# Altium project chess_module.PrjPcb
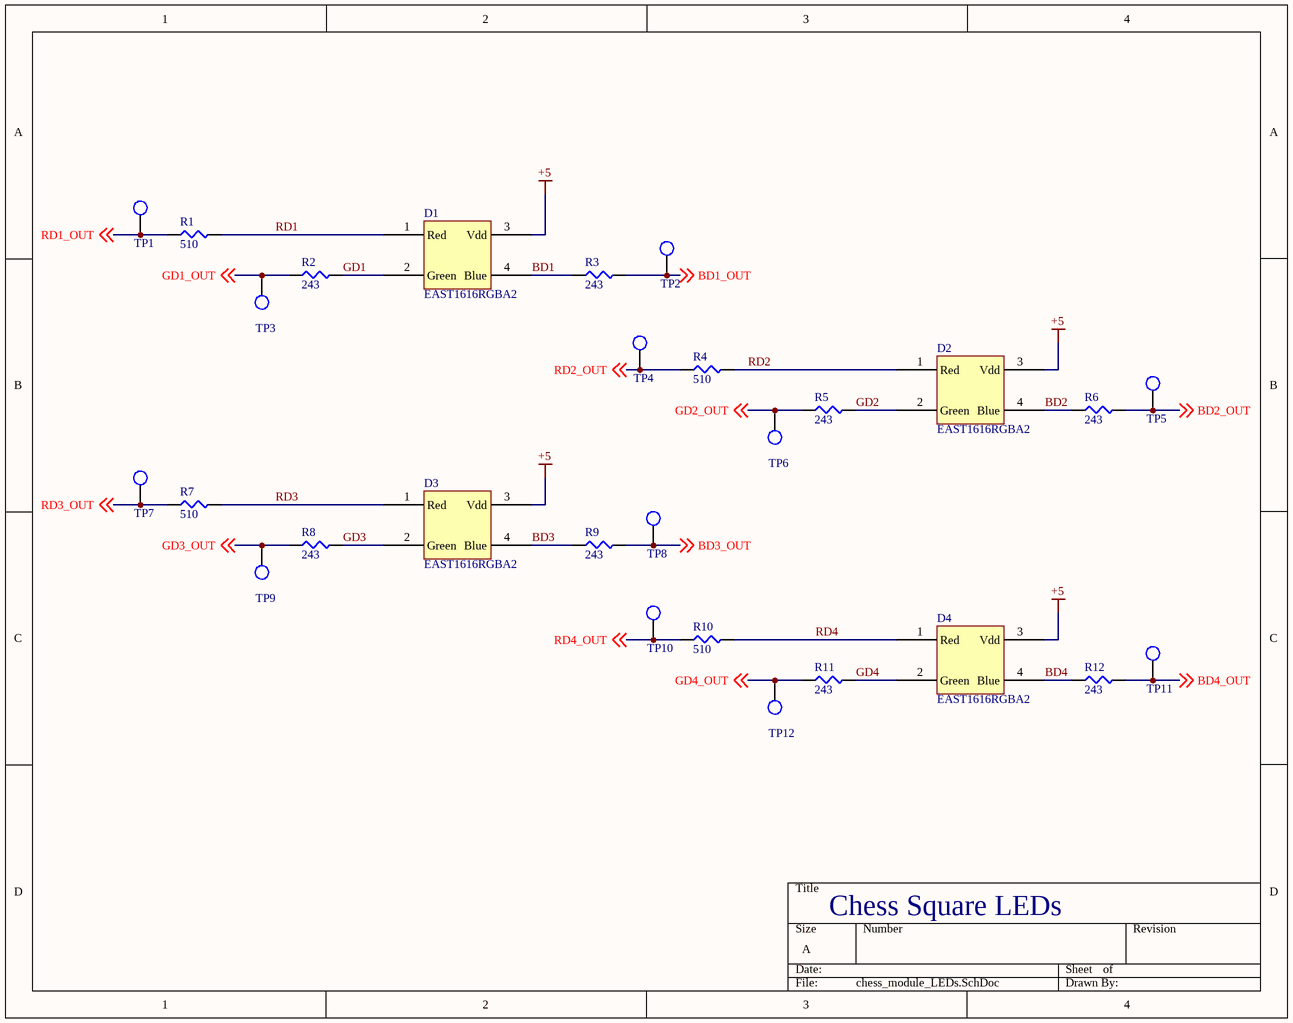
[diagram p0: chess_module_LEDs.SchDoc]
3 sheets, 52 parts. Net scope: global (net labels, ports and power ports of the same name join across sheets).
Board file: chess_module.PcbDoc
Sheets:
  chess_module_LEDs.SchDoc
  chess_module_HEF.SchDoc
  chess_module_connectors.SchDoc

## Sheet chess_module_LEDs.SchDoc
size A; SheetNumber: 1; SheetTotal: 3

### Parts
D1  EAST1616RGBA2  [EAST1616RGBA2]
D2  EAST1616RGBA2  [EAST1616RGBA2]
D3  EAST1616RGBA2  [EAST1616RGBA2]
D4  EAST1616RGBA2  [EAST1616RGBA2]
R1  510  [SMD-0805-RES]
R2  243  [SMD-0805-RES]
R3  243  [SMD-0805-RES]
R4  510  [SMD-0805-RES]
R5  243  [SMD-0805-RES]
R6  243  [SMD-0805-RES]
R7  510  [SMD-0805-RES]
R8  243  [SMD-0805-RES]
R9  243  [SMD-0805-RES]
R10  510  [SMD-0805-RES]
R11  243  [SMD-0805-RES]
R12  243  [SMD-0805-RES]
TP1  TP_1206  [TP-SMC-1206]  (value not drawn)
TP2  TP_1206  [TP-SMC-1206]  (value not drawn)
TP3  TP_1206  [TP-SMC-1206]  (value not drawn)
TP4  TP_1206  [TP-SMC-1206]  (value not drawn)
TP5  TP_1206  [TP-SMC-1206]  (value not drawn)
TP6  TP_1206  [TP-SMC-1206]  (value not drawn)
TP7  TP_1206  [TP-SMC-1206]  (value not drawn)
TP8  TP_1206  [TP-SMC-1206]  (value not drawn)
TP9  TP_1206  [TP-SMC-1206]  (value not drawn)
TP10  TP_1206  [TP-SMC-1206]  (value not drawn)
TP11  TP_1206  [TP-SMC-1206]  (value not drawn)
TP12  TP_1206  [TP-SMC-1206]  (value not drawn)

### Nets
+5: D1.3(Vdd) D2.3(Vdd) D3.3(Vdd) D4.3(Vdd)
BD1: D1.4(Blue) R3.1
BD1_OUT: R3.2 TP2.1 ; off-sheet BD1_OUT
BD2: D2.4(Blue) R6.1
BD2_OUT: R6.2 TP5.1 ; off-sheet BD2_OUT
BD3: D3.4(Blue) R9.1
BD3_OUT: R9.2 TP8.1 ; off-sheet BD3_OUT
BD4: D4.4(Blue) R12.1
BD4_OUT: R12.2 TP11.1 ; off-sheet BD4_OUT
GD1: D1.2(Green) R2.2
GD1_OUT: R2.1 TP3.1 ; off-sheet GD1_OUT
GD2: D2.2(Green) R5.2
GD2_OUT: R5.1 TP6.1 ; off-sheet GD2_OUT
GD3: D3.2(Green) R8.2
GD3_OUT: R8.1 TP9.1 ; off-sheet GD3_OUT
GD4: D4.2(Green) R11.2
GD4_OUT: R11.1 TP12.1 ; off-sheet GD4_OUT
RD1: D1.1(Red) R1.2
RD1_OUT: R1.1 TP1.1 ; off-sheet RD1_OUT
RD2: D2.1(Red) R4.2
RD2_OUT: R4.1 TP4.1 ; off-sheet RD2_OUT
RD3: D3.1(Red) R7.2
RD3_OUT: R7.1 TP7.1 ; off-sheet RD3_OUT
RD4: D4.1(Red) R10.2
RD4_OUT: R10.1 TP10.1 ; off-sheet RD4_OUT

### Notes on the sheet
- Chess Square LEDs

### Library data of the parts
R1 R4 R7 R10 = ERJ-6ENF5100V: RES SMD 510 OHM 1% 1/8W 0805; Manufacturer: Panasonic Electronic Components; Factory Stock: 0; Unit Price (USD): 0.00729; @ qty: 1500; Minimum Quantity: 1; Power (Watts): 0.125W, 1/8W; Temperature Coefficient: ±100ppm/°C; Part Number: ERJ-6ENF5100V; Datasheets: http://industrial.panasonic.com/www-cgi/jvcr13pz.cgi?E+PZ+3+AOA0002+ERJ6ENF5100V+7+WW; Image: //media.digikey.com/Renders/Panasonic%20Renders/ERJ-0805%20Pkg.jpg; Digi-Key Part Number: P510CCT-ND; Quantity Available: 80206; Packaging: Cut Tape (CT); Series: ERJ; Part Status: Active; Value: 510; Tolerance: ±1%; Composition: Thick Film; Features: Automotive AEC-Q200; Operating Temperature: -55°C ~ 155°C; Package / Case: 0805 (2012 Metric); Supplier Device Package: 0805; Size / Dimension: 0.079" L x 0.049" W (2.00mm x 1.25mm); Height - Seated (Max): 0.028" (0.70mm); Number of Terminations: 2; Failure Rate: -
R2 R3 R5 R6 R8 R9 R11 R12 = ERJ-6ENF2430V: RES SMD 243 OHM 1% 1/8W 0805; Manufacturer: Panasonic Electronic Components; Factory Stock: 0; Unit Price (USD): 0.00729; @ qty: 1500; Minimum Quantity: 1; Power (Watts): 0.125W, 1/8W; Temperature Coefficient: ±100ppm/°C; Part Number: ERJ-6ENF2430V; Datasheets: http://industrial.panasonic.com/www-cgi/jvcr13pz.cgi?E+PZ+3+AOA0002+ERJ6ENF2430V+7+WW; Image: //media.digikey.com/Renders/Panasonic%20Renders/ERJ-0805%20Pkg.jpg; Digi-Key Part Number: P243CCT-ND; Quantity Available: 46150; Packaging: Cut Tape (CT); Series: ERJ; Part Status: Active; Value: 243; Tolerance: ±1%; Composition: Thick Film; Features: Automotive AEC-Q200; Operating Temperature: -55°C ~ 155°C; Package / Case: 0805 (2012 Metric); Supplier Device Package: 0805; Size / Dimension: 0.079" L x 0.049" W (2.00mm x 1.25mm); Height - Seated (Max): 0.028" (0.70mm); Number of Terminations: 2; Failure Rate: -
TP1-TP12 = TP_1206: Test Point SMD 1206; Manufacturer: TE Connectivity (Tyco Electronics); Manufacturer Part Number: 1625854-1; Resistance Value: 0 Ohm; Temperature Coefficient: N/R; Supplier: Digi-Key; Stock 1: 31937; Pricing 1: 1=0.28, 10=0.261, 25=0.224, 50=0.1902, 100=0.1828, 250=0.1641, 500=0.1567, 1000=0.1306 (USD); Case Size: 1206; Dimension: 3.2 x 1.6 x 1.25mm; Family: RC; Mounting: Surface Mount; Operating Temperature: -55 to 125 C; Part No: 1625854-1; RoHS: Yes; Packaging: Tape and Reel; Termination Style: N/R; Terminal Pitch: N/R; Power Rating: N/R; Tolerance: N/R; ComponentLink1URL: https://datasheet.ciiva.com/6439/eng-ds-1773266-a-6439169.pdf; ComponentLink1Description: https://datasheet.ciiva.com/6439/eng-ds-1773266-a-6439169.pdf; ComponentLink2URL: https://datasheet.ciiva.com/30136/1773266-a-30136341.pdf; ComponentLink2Description: https://datasheet.ciiva.com/30136/1773266-a-30136341.pdf; ComponentLink3URL: https://datasheet.ciiva.com/6439/eng-ds-1773266-a-6439080.pdf; ComponentLink3Description: https://datasheet.ciiva.com/6439/eng-ds-1773266-a-6439080.pdf; ComponentLink4URL: https://datasheet.ciiva.com/6439/eng-ds-1773266-a-6439081.pdf; ComponentLink4Description: https://datasheet.ciiva.com/6439/eng-ds-1773266-a-6439081.pdf; ComponentLink5URL: https://datasheet.ciiva.com/6439/eng-ds-1773266-a-6439083.pdf; ComponentLink5Description: https://datasheet.ciiva.com/6439/eng-ds-1773266-a-6439083.pdf; Supplier Part Number: A106143CT-ND

## Sheet chess_module_HEF.SchDoc
size A; SheetNumber: 2; SheetTotal: 3
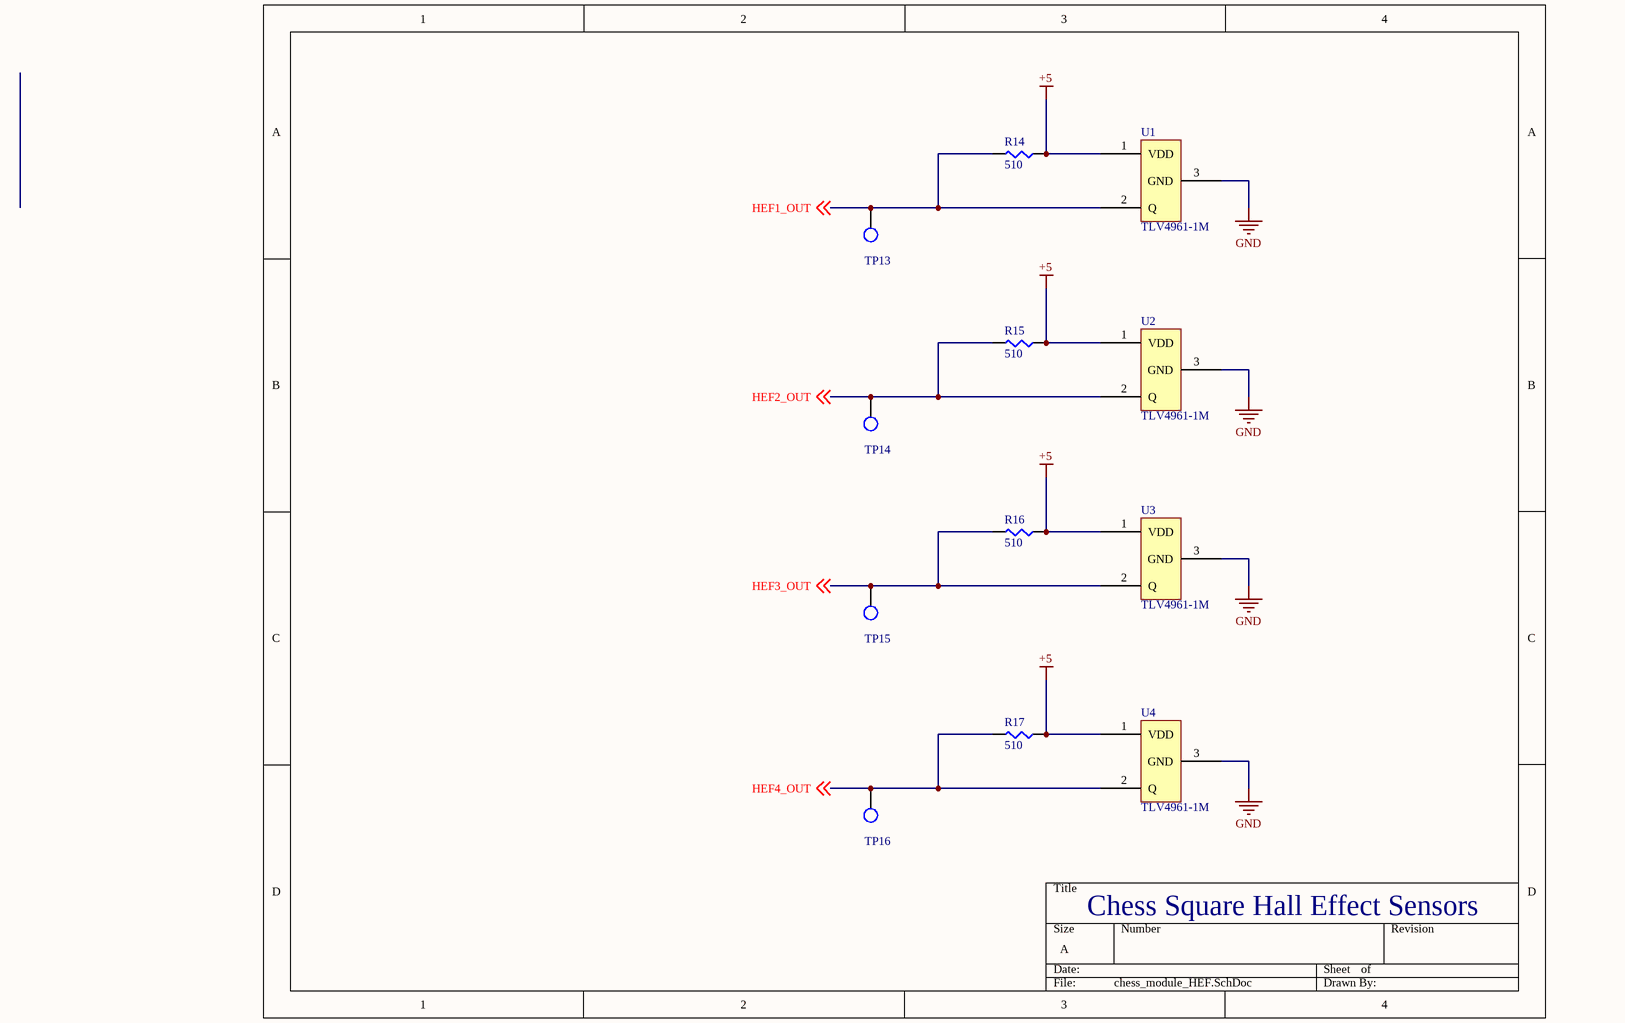
[diagram p1: chess_module_HEF.SchDoc]

### Parts
R14  510  [SMD-0805-RES]
R15  510  [SMD-0805-RES]
R16  510  [SMD-0805-RES]
R17  510  [SMD-0805-RES]
TP13  TP_1206  [TP-SMC-1206]  (value not drawn)
TP14  TP_1206  [TP-SMC-1206]  (value not drawn)
TP15  TP_1206  [TP-SMC-1206]  (value not drawn)
TP16  TP_1206  [TP-SMC-1206]  (value not drawn)
U1  TLV4961-1M  [SOT95P245X110-3N]
U2  TLV4961-1M  [SOT95P245X110-3N]
U3  TLV4961-1M  [SOT95P245X110-3N]
U4  TLV4961-1M  [SOT95P245X110-3N]

### Nets
+5: R14.1 R15.1 R16.1 R17.1 U1.1(VDD) U2.1(VDD) U3.1(VDD) U4.1(VDD)
GND: U1.3(GND) U2.3(GND) U3.3(GND) U4.3(GND)
HEF1_OUT: R14.2 TP13.1 U1.2(Q) ; off-sheet HEF1_OUT
HEF2_OUT: R15.2 TP14.1 U2.2(Q) ; off-sheet HEF2_OUT
HEF3_OUT: R16.2 TP15.1 U3.2(Q) ; off-sheet HEF3_OUT
HEF4_OUT: R17.2 TP16.1 U4.2(Q) ; off-sheet HEF4_OUT

### Notes on the sheet
- Chess Square Hall Effect Sensors

### Library data of the parts
R14-R17 = ERJ-6ENF5100V: as R1 on sheet chess_module_LEDs; Part Number: ERJ-6ENF5100V; Datasheets: http://industrial.panasonic.com/www-cgi/jvcr13pz.cgi?E+PZ+3+AOA0002+ERJ6ENF5100V+7+WW; Image: //media.digikey.com/Renders/Panasonic%20Renders/ERJ-0805%20Pkg.jpg; Digi-Key Part Number: P510CCT-ND; Quantity Available: 80206; Packaging: Cut Tape (CT); Series: ERJ; Part Status: Active; Value: 510; Tolerance: ±1%; Composition: Thick Film; Features: Automotive AEC-Q200; Operating Temperature: -55°C ~ 155°C; Package / Case: 0805 (2012 Metric); Supplier Device Package: 0805; Size / Dimension: 0.079" L x 0.049" W (2.00mm x 1.25mm); Height - Seated (Max): 0.028" (0.70mm); Number of Terminations: 2; Failure Rate: -
TP13-TP16 = TP_1206: as TP1 on sheet chess_module_LEDs; Supplier: Digi-Key; Stock 1: 31937; Pricing 1: 1=0.28, 10=0.261, 25=0.224, 50=0.1902, 100=0.1828, 250=0.1641, 500=0.1567, 1000=0.1306 (USD); Case Size: 1206; Dimension: 3.2 x 1.6 x 1.25mm; Family: RC; Mounting: Surface Mount; Operating Temperature: -55 to 125 C; Part No: 1625854-1; RoHS: Yes; Packaging: Tape and Reel; Termination Style: N/R; Terminal Pitch: N/R; Power Rating: N/R; Tolerance: N/R; ComponentLink1URL: https://datasheet.ciiva.com/6439/eng-ds-1773266-a-6439169.pdf; ComponentLink1Description: https://datasheet.ciiva.com/6439/eng-ds-1773266-a-6439169.pdf; ComponentLink2URL: https://datasheet.ciiva.com/30136/1773266-a-30136341.pdf; ComponentLink2Description: https://datasheet.ciiva.com/30136/1773266-a-30136341.pdf; ComponentLink3URL: https://datasheet.ciiva.com/6439/eng-ds-1773266-a-6439080.pdf; ComponentLink3Description: https://datasheet.ciiva.com/6439/eng-ds-1773266-a-6439080.pdf; ComponentLink4URL: https://datasheet.ciiva.com/6439/eng-ds-1773266-a-6439081.pdf; ComponentLink4Description: https://datasheet.ciiva.com/6439/eng-ds-1773266-a-6439081.pdf; ComponentLink5URL: https://datasheet.ciiva.com/6439/eng-ds-1773266-a-6439083.pdf; ComponentLink5Description: https://datasheet.ciiva.com/6439/eng-ds-1773266-a-6439083.pdf; Supplier Part Number: A106143CT-ND
U1-U4 = TLV4961-1M: Hall Effect Sensor

## Sheet chess_module_connectors.SchDoc
size A; SheetNumber: 3; SheetTotal: 3
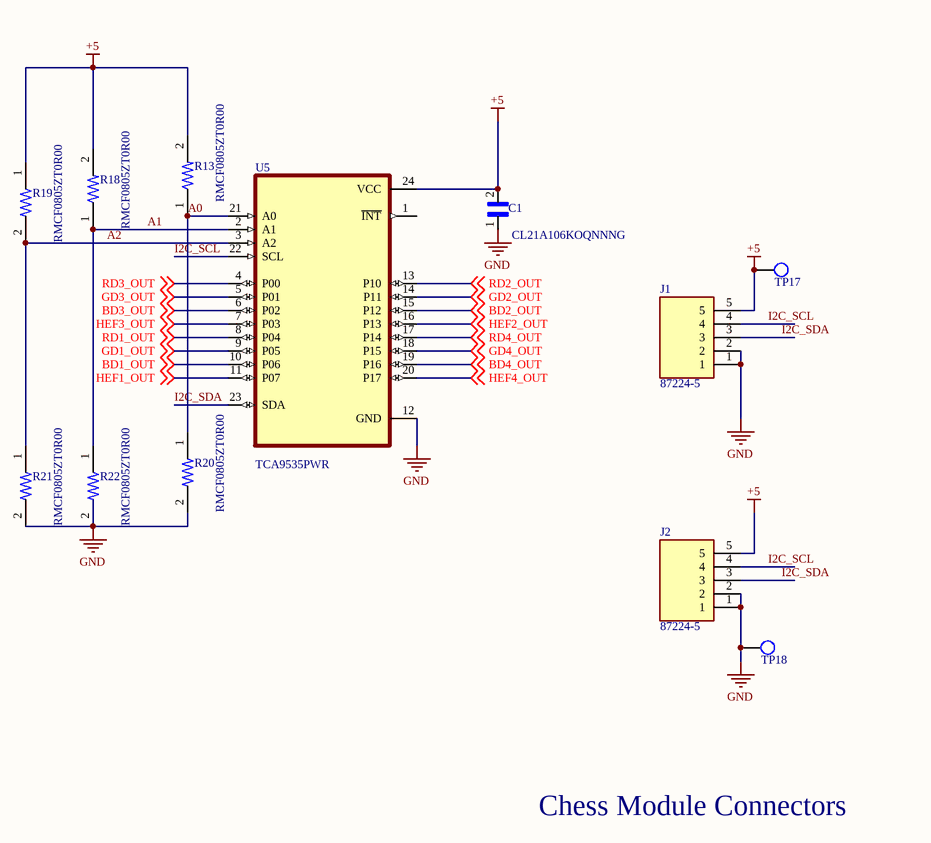
[diagram p2: chess_module_connectors.SchDoc]

### Parts
C1  CL21A106KOQNNNG  [CAPC2012X140N]
J1  87224-5  [TE_87224-5]
J2  87224-5  [TE_87224-5]
R13  RMCF0805ZT0R00  [RESC2012X60N]
R18  RMCF0805ZT0R00  [RESC2012X60N]
R19  RMCF0805ZT0R00  [RESC2012X60N]
R20  RMCF0805ZT0R00  [RESC2012X60N]
R21  RMCF0805ZT0R00  [RESC2012X60N]
R22  RMCF0805ZT0R00  [RESC2012X60N]
TP17  TP_1206  [TP-SMC-1206]  (value not drawn)
TP18  TP_1206  [TP-SMC-1206]  (value not drawn)
U5  TCA9535PWR  [SOP65P640X120-24N]

### Nets
+5: C1.2 J1.5 J2.5 R13.2 R18.2 R19.1 TP17.1 U5.24(VCC)
GND: C1.1 J1.1 J1.2 J2.1 J2.2 R20.2 R21.2 R22.2 TP18.1 U5.12(GND)
A0: R13.1 R20.1 U5.21(A0)
A1: R18.1 R22.1 U5.2(A1)
A2: R19.2 R21.1 U5.3(A2)
BD1_OUT: U5.10(P06) ; off-sheet BD1_OUT
BD2_OUT: U5.15(P12) ; off-sheet BD2_OUT
BD3_OUT: U5.6(P02) ; off-sheet BD3_OUT
BD4_OUT: U5.19(P16) ; off-sheet BD4_OUT
GD1_OUT: U5.9(P05) ; off-sheet GD1_OUT
GD2_OUT: U5.14(P11) ; off-sheet GD2_OUT
GD3_OUT: U5.5(P01) ; off-sheet GD3_OUT
GD4_OUT: U5.18(P15) ; off-sheet GD4_OUT
HEF1_OUT: U5.11(P07) ; off-sheet HEF1_OUT
HEF2_OUT: U5.16(P13) ; off-sheet HEF2_OUT
HEF3_OUT: U5.7(P03) ; off-sheet HEF3_OUT
HEF4_OUT: U5.20(P17) ; off-sheet HEF4_OUT
I2C_SCL: J1.4 J2.4 U5.22(SCL)
I2C_SDA: J1.3 J2.3 U5.23(SDA)
RD1_OUT: U5.8(P04) ; off-sheet RD1_OUT
RD2_OUT: U5.13(P10) ; off-sheet RD2_OUT
RD3_OUT: U5.4(P00) ; off-sheet RD3_OUT
RD4_OUT: U5.17(P14) ; off-sheet RD4_OUT

Not connected (* = marked no-connect by the designer): U5 1(~{INT})

### Notes on the sheet
- Chess Module Connectors

### Library data of the parts
C1 = CL21A106KOQNNNG: 10ÂµF Â±10% 16V Ceramic Capacitor X5R 0805 _2012 Metric_; MF: Samsung Electro-Mechanics; Package: 0805 Samsung; Digi-Key_Part_Number: 1276-6455-1-ND; Digi-Key_Purchase_URL: https://www.digikey.com/product-detail/en/samsung-electro-mechanics/CL21A106KOQNNNG/1276-6455-1-ND/5958083?utm_source=snapeda&utm_medium=aggregator&utm_campaign=symbol; Value: *; MP: CL21A106KOQNNNG; SnapEDA_Link: https://www.snapeda.com/parts/CL21A106KOQNNNG/Samsung%20Electro-Mechanics/view-part/3597829/?ref=snap
J1 J2 = 87224-5: Conn Unshrouded Header HDR 5 POS 2.54mm Solder ST Thru-Hole; Number_of_Positions: 5; MF: TE Connectivity; Product_Type: Connector; Centerline_Pitch: 2.54 mm[.1 in]; Price: None; SnapEDA_Link: https://www.snapeda.com/parts/87224-5/TE%20Connectivity%20AMP%20Connectors/view-part/1233389/?ref=snap; EU_RoHS_Compliance: Compliant; MP: 87224-5; Value: *; Availability: Good; Package: None; Purchase-URL: https://pricing.snapeda.com/search/part/87224-5/?ref=eda
R13 R18-R22 = RMCF0805ZT0R00: 0 Ohms Jumper 0.125W, 1/8W Chip Resistor 0805 (2012 Metric) Automotive AEC-Q200 Thick Film; MF: Stackpole Electronics; DigiKey-Purchase-URL: https://snapeda.com/shop?store=DigiKey&id=492501; Package: 0805 Stackpole Electronics; Availability: Unavailable; MP: RMCF0805ZT0R00; SnapEDA_Link: https://www.snapeda.com/parts/RMCF0805ZT0R00/Stackpole%20Electronics%20Inc/view-part/492501/?ref=snap; Price: None; Value: *
TP17 TP18 = TP_1206: as TP1 on sheet chess_module_LEDs; Supplier: Digi-Key; Stock 1: 31937; Pricing 1: 1=0.28, 10=0.261, 25=0.224, 50=0.1902, 100=0.1828, 250=0.1641, 500=0.1567, 1000=0.1306 (USD); Case Size: 1206; Dimension: 3.2 x 1.6 x 1.25mm; Family: RC; Mounting: Surface Mount; Operating Temperature: -55 to 125 C; Part No: 1625854-1; RoHS: Yes; Packaging: Tape and Reel; Termination Style: N/R; Terminal Pitch: N/R; Power Rating: N/R; Tolerance: N/R; ComponentLink1URL: https://datasheet.ciiva.com/6439/eng-ds-1773266-a-6439169.pdf; ComponentLink1Description: https://datasheet.ciiva.com/6439/eng-ds-1773266-a-6439169.pdf; ComponentLink2URL: https://datasheet.ciiva.com/30136/1773266-a-30136341.pdf; ComponentLink2Description: https://datasheet.ciiva.com/30136/1773266-a-30136341.pdf; ComponentLink3URL: https://datasheet.ciiva.com/6439/eng-ds-1773266-a-6439080.pdf; ComponentLink3Description: https://datasheet.ciiva.com/6439/eng-ds-1773266-a-6439080.pdf; ComponentLink4URL: https://datasheet.ciiva.com/6439/eng-ds-1773266-a-6439081.pdf; ComponentLink4Description: https://datasheet.ciiva.com/6439/eng-ds-1773266-a-6439081.pdf; ComponentLink5URL: https://datasheet.ciiva.com/6439/eng-ds-1773266-a-6439083.pdf; ComponentLink5Description: https://datasheet.ciiva.com/6439/eng-ds-1773266-a-6439083.pdf; Supplier Part Number: A106143CT-ND
U5 = TCA9535PWR: Remote 16-Bit I2C and SMBus, Low-Power I/O Expander With Interrupt Output and Config Registers 24-TSSOP -40 to 85; MF: Texas Instruments; Texas_Instruments-Purchase-URL: https://snapeda.com/shop?store=Texas+Instruments&id=1237891; SnapEDA_Link: https://www.snapeda.com/parts/TCA9535PWR/Texas%20Instruments/view-part/1237891/?ref=snap; Availability: Good; Price: None; MP: TCA9535PWR; DigiKey-Purchase-URL: https://snapeda.com/shop?store=DigiKey&id=1237891; Package: TSSOP-24 Texas Instruments; Mouser-Purchase-URL: https://snapeda.com/shop?store=Mouser&id=1237891; Arrow_Electronics-Purchase-URL: https://snapeda.com/shop?store=Arrow+Electronics&id=1237891; Value: *

## Nets that join several sheets
+5: chess_module_LEDs (D1.3 D2.3 D3.3 D4.3), chess_module_HEF (8 pins), chess_module_connectors (8 pins)
GND: chess_module_HEF (U1.3 U2.3 U3.3 U4.3), chess_module_connectors (10 pins)
BD1_OUT: chess_module_LEDs (R3.2 TP2.1), chess_module_connectors (U5.10)
BD2_OUT: chess_module_LEDs (R6.2 TP5.1), chess_module_connectors (U5.15)
BD3_OUT: chess_module_LEDs (R9.2 TP8.1), chess_module_connectors (U5.6)
BD4_OUT: chess_module_LEDs (R12.2 TP11.1), chess_module_connectors (U5.19)
GD1_OUT: chess_module_LEDs (R2.1 TP3.1), chess_module_connectors (U5.9)
GD2_OUT: chess_module_LEDs (R5.1 TP6.1), chess_module_connectors (U5.14)
GD3_OUT: chess_module_LEDs (R8.1 TP9.1), chess_module_connectors (U5.5)
GD4_OUT: chess_module_LEDs (R11.1 TP12.1), chess_module_connectors (U5.18)
HEF1_OUT: chess_module_HEF (R14.2 TP13.1 U1.2), chess_module_connectors (U5.11)
HEF2_OUT: chess_module_HEF (R15.2 TP14.1 U2.2), chess_module_connectors (U5.16)
HEF3_OUT: chess_module_HEF (R16.2 TP15.1 U3.2), chess_module_connectors (U5.7)
HEF4_OUT: chess_module_HEF (R17.2 TP16.1 U4.2), chess_module_connectors (U5.20)
RD1_OUT: chess_module_LEDs (R1.1 TP1.1), chess_module_connectors (U5.8)
RD2_OUT: chess_module_LEDs (R4.1 TP4.1), chess_module_connectors (U5.13)
RD3_OUT: chess_module_LEDs (R7.1 TP7.1), chess_module_connectors (U5.4)
RD4_OUT: chess_module_LEDs (R10.1 TP10.1), chess_module_connectors (U5.17)